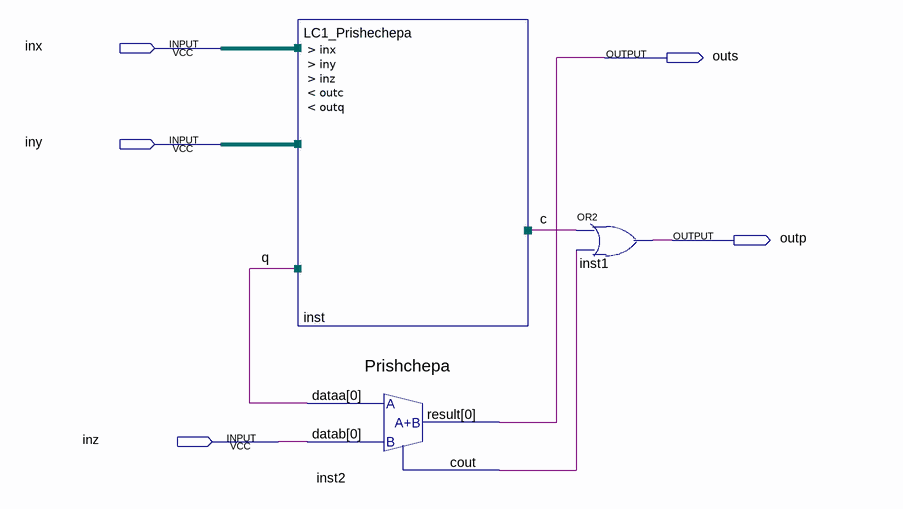
[diagram p0: schematic sheet]
// Quartus schematic Prishchepa_Vladislav.bdf as structural Verilog: 3 symbols, 5 pins
module Prishchepa_Vladislav (
  input  inx,
  input  iny,
  input  inz,
  output outs,
  output outp
);

  wire c, inst2_cout, q;

  LC1_Prishechepa inst (.inx(inx), .iny(iny), .outc(c), .outq(q));  // open: inz
  Prishchepa inst2 (.dataa(q), .datab(inz), .result(outs), .cout(inst2_cout));
  or inst1 (outp, c, inst2_cout);
endmodule
